# EAGLE design amplifier (EAGLE 8.4.1)
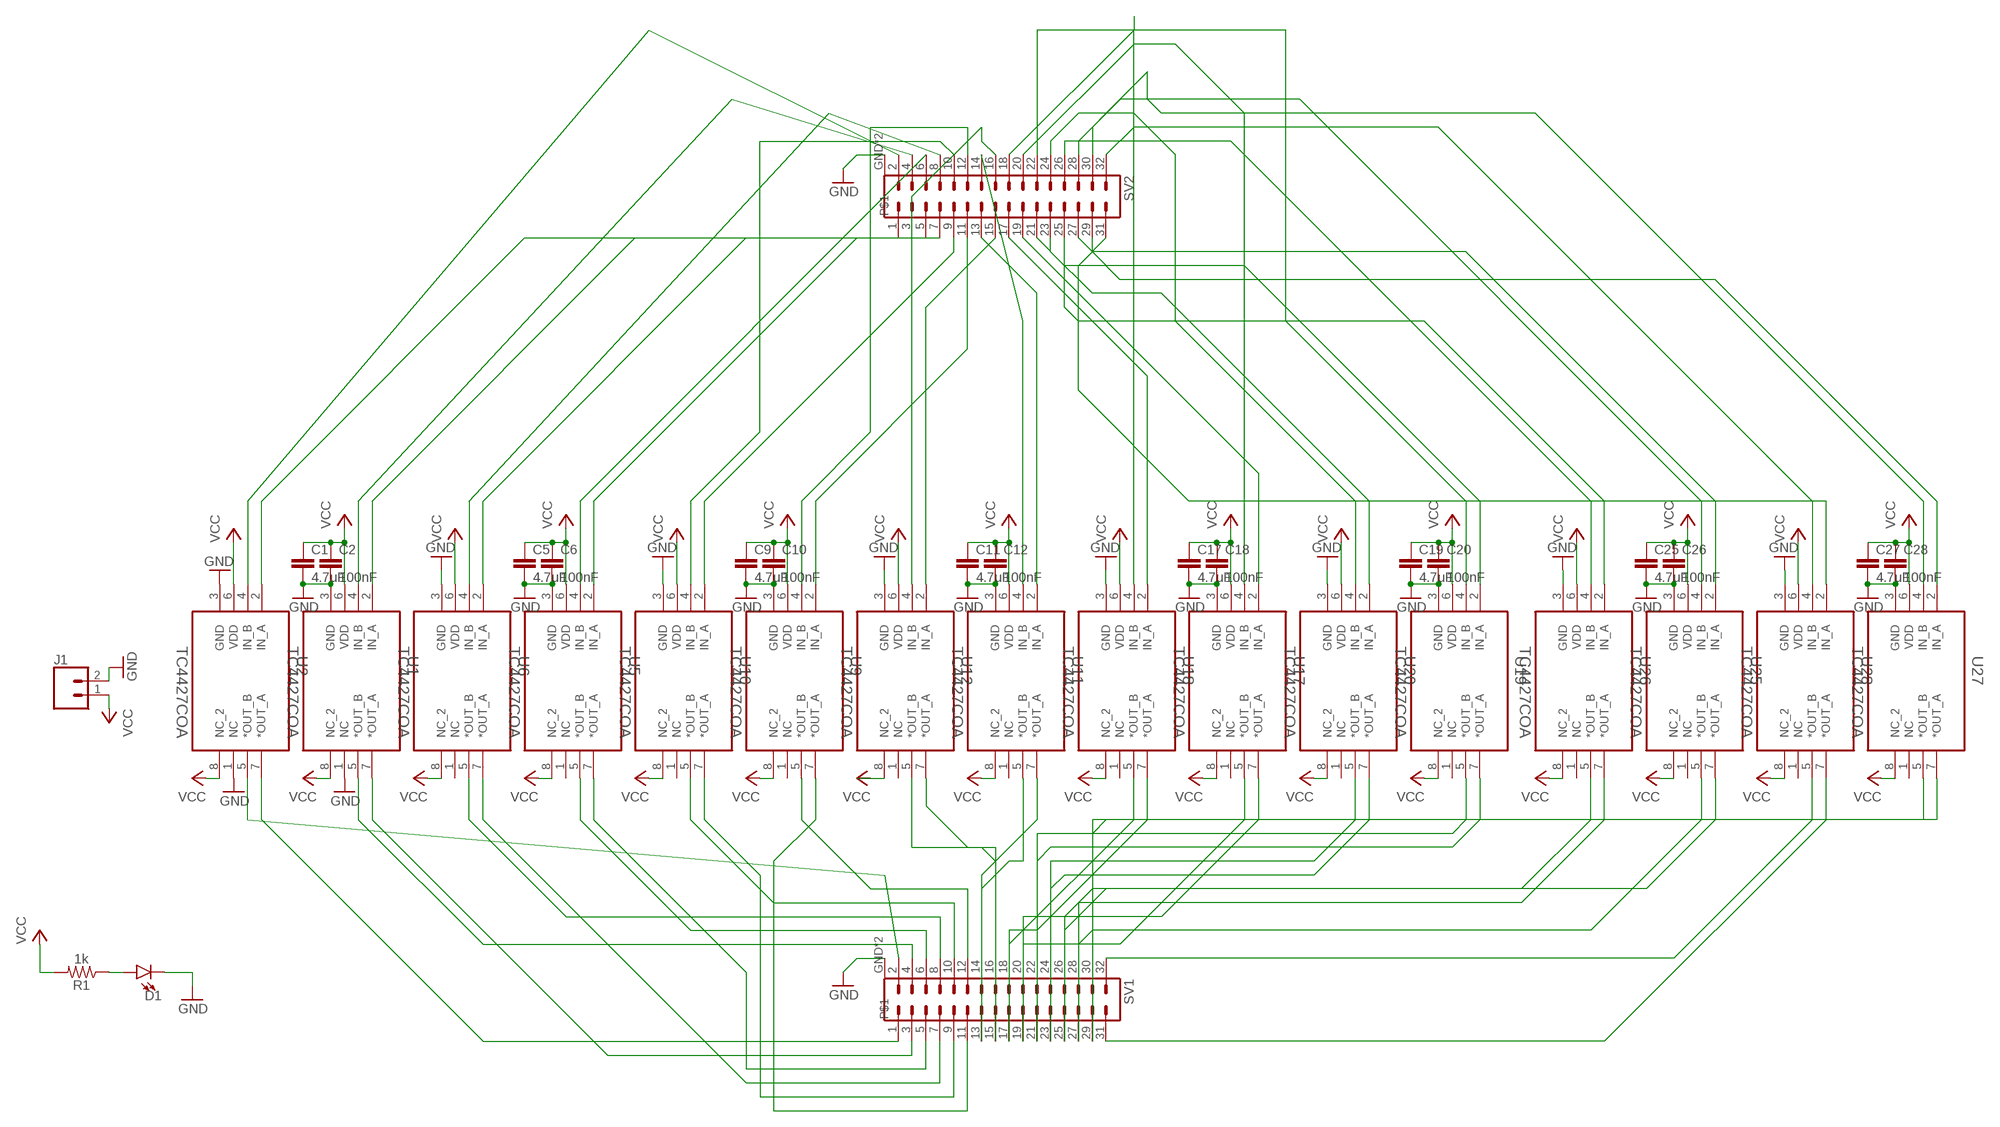
[diagram p0: schematic, sheet 1]

## Parts
C1  4.7uF  C-EUC0805  [C0805]
C2  100nF  C-EUC0805  [C0805]
C5  4.7uF  C-EUC0805  [C0805]
C6  100nF  C-EUC0805  [C0805]
C9  4.7uF  C-EUC0805  [C0805]
C10  100nF  C-EUC0805  [C0805]
C11  4.7uF  C-EUC0805  [C0805]
C12  100nF  C-EUC0805  [C0805]
C17  4.7uF  C-EUC0805  [C0805]
C18  100nF  C-EUC0805  [C0805]
C19  4.7uF  C-EUC0805  [C0805]
C20  100nF  C-EUC0805  [C0805]
C25  4.7uF  C-EUC0805  [C0805]
C26  100nF  C-EUC0805  [C0805]
C27  4.7uF  C-EUC0805  [C0805]
C28  100nF  C-EUC0805  [C0805]
D1  LED0603  [LED-0603]
J1  CONN_02PTH3  [1X02_LONGPADS]
R1  1k  0.22OHM-0805-1/4W-1%  [0805]
SV1  MA20-2W  [MA20-2W]
SV2  MA20-2W  [MA20-2W]
U1  TC4427COA  [SOIC127P600X175-8N]
U2  TC4427COA  [SOIC127P600X175-8N]
U5  TC4427COA  [SOIC127P600X175-8N]
U6  TC4427COA  [SOIC127P600X175-8N]
U9  TC4427COA  [SOIC127P600X175-8N]
U10  TC4427COA  [SOIC127P600X175-8N]
U11  TC4427COA  [SOIC127P600X175-8N]
U12  TC4427COA  [SOIC127P600X175-8N]
U17  TC4427COA  [SOIC127P600X175-8N]
U18  TC4427COA  [SOIC127P600X175-8N]
U19  TC4427COA  [SOIC127P600X175-8N]
U20  TC4427COA  [SOIC127P600X175-8N]
U25  TC4427COA  [SOIC127P600X175-8N]
U26  TC4427COA  [SOIC127P600X175-8N]
U27  TC4427COA  [SOIC127P600X175-8N]
U28  TC4427COA  [SOIC127P600X175-8N]

## Nets
GND: C1.2 C2.2 C5.2 C6.2 C9.2 C10.2 C11.2 C12.2 C17.2 C18.2 C19.2 C20.2 C25.2 C26.2 C27.2 C28.2 D1.C J1.2 SV1.GND SV1.GND+1 SV2.GND SV2.GND+1 U1.1(NC) U1.3(GND) U2.1(NC) U2.3(GND) U5.1(NC) U5.3(GND) U6.1(NC) U6.3(GND) U9.1(NC) U9.3(GND) U10.1(NC) U10.3(GND) U11.1(NC) U11.3(GND) U12.1(NC) U12.3(GND) U17.1(NC) U17.3(GND) U18.1(NC) U18.3(GND) U19.1(NC) U19.3(GND) U20.1(NC) U20.3(GND) U25.1(NC) U25.3(GND) U26.1(NC) U26.3(GND) U27.1(NC) U27.3(GND) U28.1(NC) U28.3(GND)
N$1: SV2.2 U2.4(IN_B)
N$2: SV1.2 U2.5(*OUT_B)
N$3: SV1.4 U1.5(*OUT_B)
N$4: SV2.4 U1.4(IN_B)
N$5: SV2.3 U1.2(IN_A)
N$6: SV2.1 U2.2(IN_A)
N$7: SV1.16 U12.5(*OUT_B)
N$8: SV1.24 U20.5(*OUT_B)
N$9: SV1.8 U6.5(*OUT_B)
N$10: SV1.1 U2.7(*OUT_A)
N$11: SV1.3 U1.7(*OUT_A)
N$12: SV1.7 U6.7(*OUT_A)
N$13: SV1.10 U10.5(*OUT_B)
N$14: SV1.9 U10.7(*OUT_A)
N$15: SV1.11 U9.7(*OUT_A)
N$16: SV1.23 U20.7(*OUT_A)
N$17: SV2.6 U5.4(IN_B)
N$18: SV2.5 U5.2(IN_A)
N$19: SV2.8 U6.4(IN_B)
N$20: D1.A R1.1
N$22: SV2.7 U6.2(IN_A)
N$23: SV1.5 U5.7(*OUT_A)
N$24: SV1.6 U5.5(*OUT_B)
N$26: SV1.15 U12.7(*OUT_A)
N$29: SV1.12 U9.5(*OUT_B)
N$33: SV2.12 U9.4(IN_B)
N$34: SV2.11 U9.2(IN_A)
N$35: SV2.10 U10.4(IN_B)
N$38: SV2.9 U10.2(IN_A)
N$41: SV2.14 U11.4(IN_B)
N$42: SV2.13 U11.2(IN_A)
N$43: SV2.16 U12.4(IN_B)
N$46: SV2.15 U12.2(IN_A)
N$47: SV1.13 U11.7(*OUT_A)
N$48: SV1.14 U11.5(*OUT_B)
N$65: SV2.20 U17.4(IN_B)
N$66: SV2.19 U17.2(IN_A)
N$67: SV2.18 U18.4(IN_B)
N$68: SV1.17 U18.7(*OUT_A)
N$69: SV1.18 U18.5(*OUT_B)
N$70: SV2.17 U18.2(IN_A)
N$71: SV1.19 U17.7(*OUT_A)
N$72: SV1.20 U17.5(*OUT_B)
N$73: SV2.22 U19.4(IN_B)
N$74: SV2.21 U19.2(IN_A)
N$75: SV2.24 U20.4(IN_B)
N$78: SV2.23 U20.2(IN_A)
N$79: SV1.21 U19.7(*OUT_A)
N$80: SV1.22 U19.5(*OUT_B)
N$97: SV2.28 U25.4(IN_B)
N$98: SV2.27 U25.2(IN_A)
N$99: SV2.26 U26.4(IN_B)
N$100: SV1.25 U26.7(*OUT_A)
N$101: SV1.26 U26.5(*OUT_B)
N$102: SV2.25 U26.2(IN_A)
N$103: SV1.27 U25.7(*OUT_A)
N$104: SV1.28 U25.5(*OUT_B)
N$105: SV2.30 U27.4(IN_B)
N$106: SV2.29 U27.2(IN_A)
N$107: SV2.32 U28.4(IN_B)
N$108: SV1.31 U28.7(*OUT_A)
N$109: SV1.32 U28.5(*OUT_B)
N$110: SV2.31 U28.2(IN_A)
N$111: SV1.29 U27.7(*OUT_A)
N$112: SV1.30 U27.5(*OUT_B)
VDD: C1.1 C2.1 C5.1 C6.1 C9.1 C10.1 C11.1 C12.1 C17.1 C18.1 C19.1 C20.1 C25.1 C26.1 C27.1 C28.1 J1.1 R1.2 U1.6(VDD) U1.8(NC_2) U2.6(VDD) U2.8(NC_2) U5.6(VDD) U5.8(NC_2) U6.6(VDD) U6.8(NC_2) U9.6(VDD) U9.8(NC_2) U10.6(VDD) U10.8(NC_2) U11.6(VDD) U11.8(NC_2) U12.6(VDD) U12.8(NC_2) U17.6(VDD) U17.8(NC_2) U18.6(VDD) U18.8(NC_2) U19.6(VDD) U19.8(NC_2) U20.6(VDD) U20.8(NC_2) U25.6(VDD) U25.8(NC_2) U26.6(VDD) U26.8(NC_2) U27.6(VDD) U27.8(NC_2) U28.6(VDD) U28.8(NC_2) ; supply symbol labelled VCC

## Library data of the parts
C1 C2 C5 C6 C9-C12 C17-C20 C25-C28 = rcl:C-EU: CAPACITOR, European symbol
D1 = SparkFun-LED:LED: LED (Generic) Standard schematic elements and footprints for 5mm, 3mm, 1206, and 0603 sized LEDs. Generic LEDs with no color specified.
J1 = SparkFun-Connectors:CONN_02: Multi connection point. Often used as Generic Header-pin footprint for 0.1 inch spaced/style header connections On any of the 0.1 inch spaced packages, you can populate with these: Break Away Headers - Straight <https://www.sparkfun.com/products/116> (PRT-00116) Break Away Male Headers - Right Angle <https://www.sparkfun.com/products/553> (PRT-00553) Female Headers <https://www.sparkfun.com/products/115> (PRT-00115) Break Away Headers - Machine Pin <https://www.sparkfun.com/products/117> (PRT-00117) Break Away Female Headers - Swiss Machine Pin <https://www.sparkfun.com/products/743> (PRT-00743) For SCREWTERMINALS and SPRING TERMINALS visit here: Screw Terimnals on SparkFun.com <https://www.sparkfun.com/search/results?term=Screw+Terminals> (5mm/3.5mm/2.54mm spacing) This device is also useful as a general connection point to wire up your design to another part of your project. Our various solder wires solder well into these plated through hole pads. Hook-Up Wire - Assortment (Stranded, 22 AWG) <https://www.sparkfun.com/products/11375> (PRT-11375) Hook-Up Wire - Assortment (Solid Core, 22 AWG) <https://www.sparkfun.com/products/11367> (PRT-11367) View the entire wire category on our website here <https://www.sparkfun.com/categories/141> Special notes: Molex polarized connector foot print use with: PRT-08233 with associated crimp pins and housings. 2.54_SCREWTERM for use with PRT-10571. 3.5mm Screw Terminal footprints for PRT-08084 5mm Screw Terminal footprints for use with PRT-08432
R1 = SparkFun-Resistors:0.22OHM: 0.22Ω resistor A resistor is a passive two-terminal electrical component that implements electrical resistance as a circuit element. Resistors act to reduce current flow, and, at the same time, act to lower voltage levels within circuits. - Wikipedia; PROD_ID: RES-09883; VALUE: 0.22
SV1 SV2 = Parts:MA20-2W: PIN HEADER; OC_FARNELL: unknown; OC_NEWARK: unknown
U1 U2 U5 U6 U9-U12 U17-U20 U25-U28 = Microchip_By_element14_Batch_1:TC4427COA: IC, MOSFET DRIVER, LOW SIDE; MPN: TC4427COA; OC_FARNELL: 9762620; OC_NEWARK: 61K3538; PACKAGE: 8SOIC; SUPPLIER: Microchip

## Net classes
0 default: width 0.406 mm

## Board
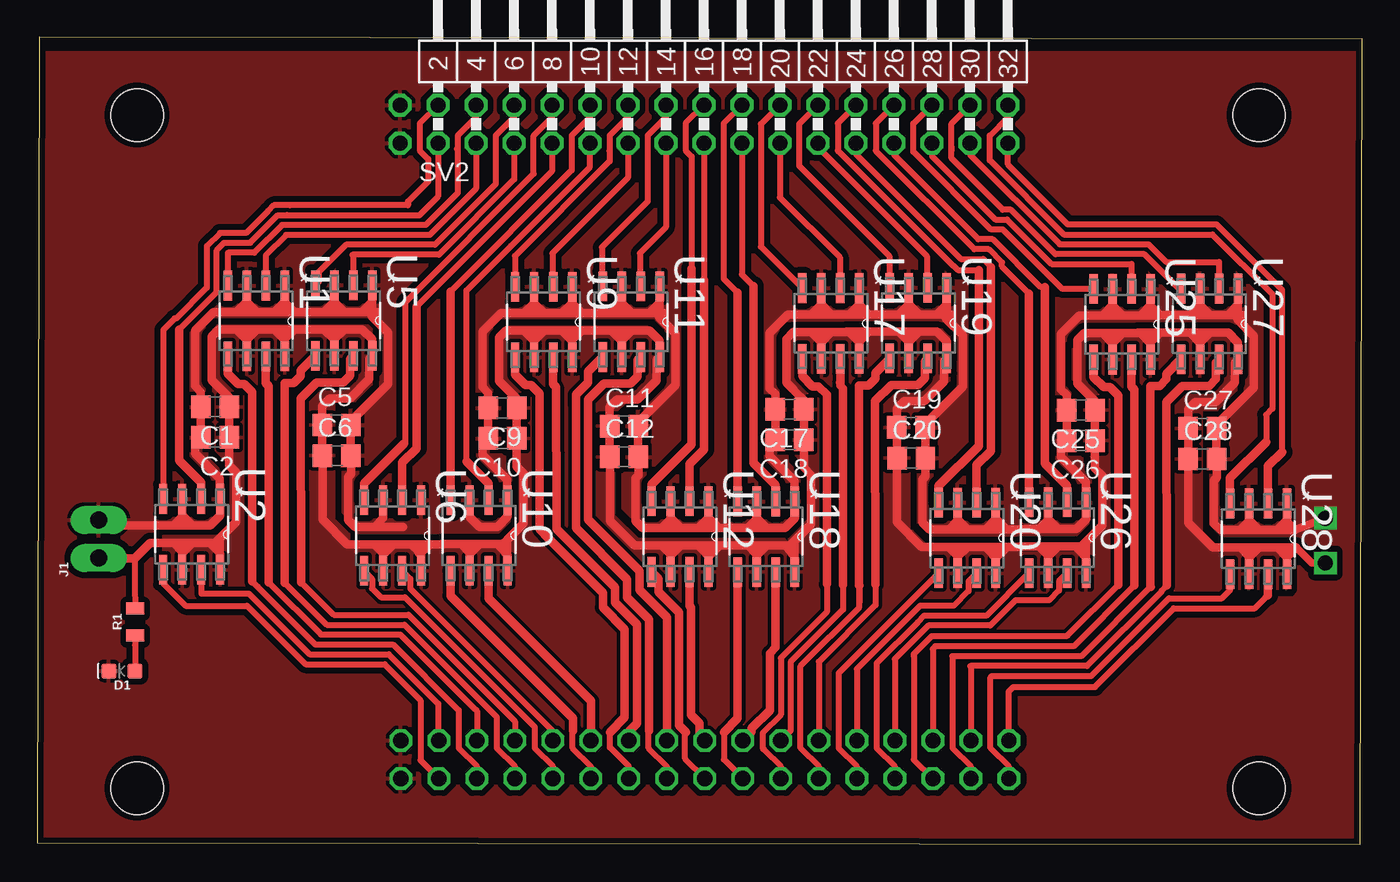
[diagram p1: board, top side]
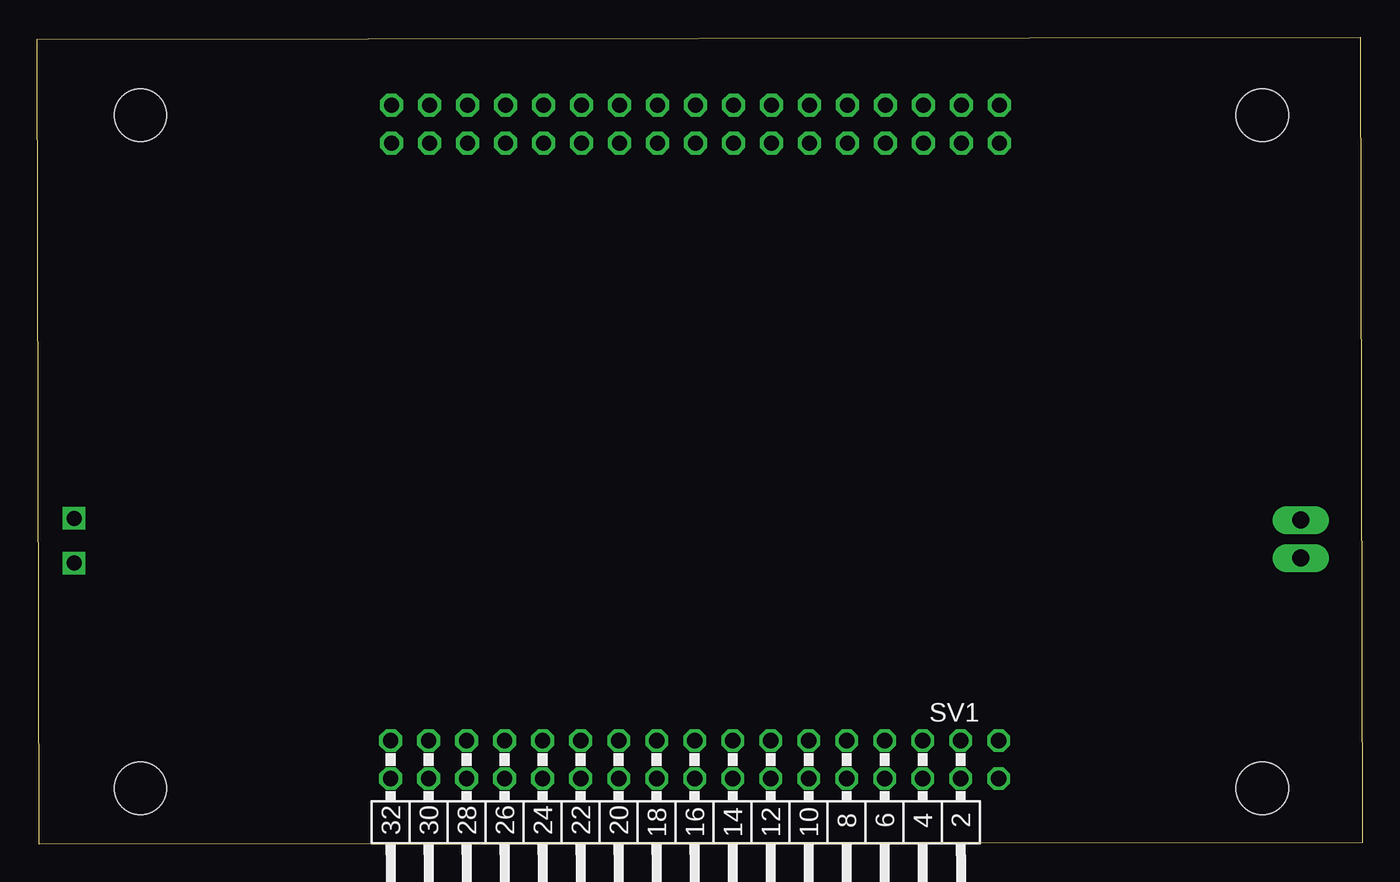
[diagram p2: board, bottom side, seen from below]

Size 88.55 x 53.95 mm. Coordinates in mm from the lower left corner, seen from the top.
Outline: 0,0.11 88.44,0 88.55,53.84 0.11,53.96 0,0.11
Copper layers (1*16): Top 0.035mm / dielectric 1.5mm / Bottom 0.035mm
Design rules "steve": minimum track width 10mil, minimum drill 24mil, track to track 10mil, track to pad 10mil, pad to pad 10mil, via to via 10mil, smd to smd 10mil, copper to edge 10mil, drill to drill 10mil, minimum pad ring 10mil, minimum via ring 10mil, stop-mask expansion 4mil, vias tented up to drill 0mil, thermal gap 10mil
Holes 3.5 mm at 6.66,48.76 81.66,48.76 81.66,3.76 6.66,3.76

### Footprints (pad centres in the part's own frame; a part is rotated, then mirrored left to right if it is on the bottom)
C0805 = smd 1.3 x 1.5: 1 -0.95,0; 2 0.95,0
LED-0603 = smd 1 x 1: A -0.877,0; C 0.877,0
1X02_LONGPADS = drill 1.118 pad 1.88 long: 1 0,0; 2 2.54,0
0805 = smd 0.8 x 1.2: 1 -0.9,0; 2 0.9,0
MA20-2W = drill 1.016 octagon: 1 -24.13,-1.27; 2 -24.13,1.27; 3 -21.59,-1.27; 4 -21.59,1.27; 5 -19.05,-1.27; 6 -19.05,1.27; 7 -16.51,-1.27; 8 -16.51,1.27; 9 -13.97,-1.27; 10 -13.97,1.27; 11 -11.43,-1.27; 12 -11.43,1.27; 13 -8.89,-1.27; 14 -8.89,1.27; 15 -6.35,-1.27; 16 -6.35,1.27; 17 -3.81,-1.27; 18 -3.81,1.27; 19 -1.27,-1.27; 20 -1.27,1.27; 21 1.27,-1.27; 22 1.27,1.27; 23 3.81,-1.27; 24 3.81,1.27; 25 6.35,-1.27; 26 6.35,1.27; 27 8.89,-1.27; 28 8.89,1.27; 29 11.43,-1.27; 30 11.43,1.27; 31 13.97,-1.27; 32 13.97,1.27; GND -26.67,1.27; GND+1 -26.67,-1.27
SOIC127P600X175-8N = smd 1.981 x 0.559: 1 -2.362,1.905; 2 -2.362,0.635; 3 -2.362,-0.635; 4 -2.362,-1.905; 5 2.362,-1.905; 6 2.362,-0.635; 7 2.362,0.635; 8 2.362,1.905

### Placement (x,y rotation side)
C1  11.88,29.25 180 top
C2  11.87,27.22 180 top
C5  20,28.04 0 top
C6  20.01,25.99 0 top
C9  31.09,29.18 180 top
C10  31.08,27.14 180 top
C11  39.21,27.97 0 top
C12  39.22,25.92 0 top
C17  50.28,29.09 180 top
C18  50.28,27.05 180 top
C19  58.4,27.88 0 top
C20  58.41,25.83 0 top
C25  69.75,29.03 180 top
C26  69.75,26.99 180 top
C27  77.87,27.82 0 top
C28  77.88,25.77 0 top
D1  5.65,11.59 180 top
J1  4.1,19.15 90 top
R1  6.54,14.87 90 top
SV1  50.96,5.67 180 bottom
SV2  50.91,48.16 0 top
U1  14.63,35 270 top
U2  10.31,20.73 270 top
U5  20.48,35.02 270 top
U6  23.75,20.65 270 top
U9  33.84,34.92 270 top
U10  29.52,20.65 270 top
U11  39.69,34.95 270 top
U12  42.96,20.58 270 top
U17  53.03,34.83 270 top
U18  48.72,20.56 270 top
U19  58.88,34.85 270 top
U20  62.15,20.49 270 top
U25  72.5,34.77 270 top
U26  68.19,20.51 270 top
U27  78.35,34.8 270 top
U28  81.62,20.43 270 top

### Tracks (layer width: path | path; a pad name or v marks a point on that pad's centre or on a via)
GND  (via drill 1 pad 1.3)
  Top 0.508: 84.06,21.01 86.04,21.81 v86.1,21.79
  Top 0.559: C1.2 C2.2 10.54,26.84 10.54,26.12 12.2,24.47 12.2,23.84 12.22,23.82 U2.1 12.23,23.08 12.23,21.99 11.56,21.31 10.34,21.31 9.68,21.98 U2.3 9.68,21.89 9.1,21.31 | C1.2 10.54,29.64 | 14.66,35.58 14,36.25 | U1.1 16.54,36.25 15.87,35.58 14.66,35.58 | C1.2 10.93,30.26 10.54,30.65 10.54,34.35 11.78,35.58 13.33,35.58 | 13.33,35.58 14.66,35.58 | U1.3 14,36.25 | 14,36.25 13.33,35.58 | 9.1,21.31 11.02,21.31 | 9.1,21.31 8.19,21.31 | 8.19,21.31 8.18,21.31 | 16.48,35.58 15.4,35.58 | 16.48,35.58 16.84,35.58 | U1.1 16.54,35.63 16.5,35.6 | 20.51,35.6 19.84,36.27 | 20.51,35.6 21.72,35.6 22.38,36.27 U5.1 22.38,35.66 22.33,35.6 | 19.18,35.6 20.51,35.6 | U5.3 19.84,36.27 | 19.84,36.27 19.18,35.6 | 22.53,21.23 24.45,21.23 | 21.91,21.23 21.62,21.23 21.61,21.23 | 21.91,21.23 22.53,21.23 | U6.3 23.11,21.81 22.53,21.23 | 21.25,35.6 22.33,35.6 | 22.33,35.6 22.69,35.6 | 17.15,35.6 19.18,35.6 | 17.15,35.6 16.5,35.6 | 16.5,35.6 16.48,35.58 | U1.1 16.54,36.22 17.15,35.6 | 22.33,35.6 22.33,35.33 23.45,34.21 23.45,30.78 20.95,28.27 C5.2 20.95,26 C6.2 20.96,24.75 20.77,24.57 20.77,21.7 21.24,21.23 21.91,21.23 | 21.91,21.23 | U10.3 28.89,21.9 29.55,21.24 30.77,21.24 31.44,21.91 31.44,23 U10.1 31.43,23.75 31.41,23.77 31.41,24.39 29.75,26.05 29.75,26.76 C10.2 C9.2 | C9.2 29.75,29.57 | 33.87,35.51 33.2,36.17 | U9.1 35.74,36.17 35.08,35.51 33.87,35.51 | C9.2 30.14,30.19 29.75,30.57 29.75,34.27 30.99,35.51 32.54,35.51 | 32.54,35.51 33.87,35.51 | U9.3 33.2,36.17 | 33.2,36.17 32.54,35.51 | 35.69,35.51 34.61,35.51 | 35.69,35.51 36.05,35.51 36.05,35.5 | U9.1 35.74,35.56 35.71,35.53 | 44.2,21.16 44.87,21.83 44.87,22.93 U12.1 44.86,21.84 45.54,21.16
  Top 0.559: 44.2,21.16 42.98,21.16 42.32,21.83 U12.3 42.32,21.74 41.74,21.16 | 39.72,35.53 39.05,36.19 | 39.72,35.53 40.93,35.53 41.59,36.19 U11.1 41.59,35.58 41.54,35.53 | 38.39,35.53 39.72,35.53 | U11.3 39.05,36.19 | 39.05,36.19 38.39,35.53 | 41.74,21.16 43.66,21.16 | 41.12,21.16 40.83,21.16 40.82,21.16 | 41.12,21.16 41.74,21.16 | 40.45,35.53 41.54,35.53 | 41.54,35.53 41.9,35.53 41.9,35.52 | 36.36,35.53 38.39,35.53 | 36.36,35.53 35.71,35.53 | 35.71,35.53 35.69,35.51 | U9.1 35.74,36.15 36.36,35.53 | 41.54,35.53 41.54,35.26 42.66,34.14 42.66,30.71 40.15,28.2 C11.2 40.15,25.93 C12.2 40.17,24.68 39.98,24.49 39.98,21.62 40.44,21.16 41.12,21.16 | 41.12,21.16 | C17.2 C18.2 48.95,26.67 48.95,25.95 50.6,24.3 50.6,23.68 50.62,23.66 U18.1 50.64,22.91 50.64,21.82 49.96,21.15 48.75,21.15 48.08,21.81 U18.3 48.08,21.73 47.5,21.15 | C17.2 48.95,29.48 | 53.06,35.42 52.4,36.08 | U17.1 54.94,36.08 54.27,35.42 53.06,35.42 | C17.2 49.33,30.1 48.95,30.48 48.95,34.18 50.18,35.42 51.73,35.42 | 51.73,35.42 53.06,35.42 | U17.3 52.4,36.08 | 52.4,36.08 51.73,35.42 | 47.5,21.15 49.43,21.15 | 47.14,21.15 46.59,21.15 46.58,21.14 | 47.14,21.15 47.5,21.15 | 54.89,35.42 53.8,35.42 | 54.89,35.42 55.24,35.42 55.25,35.41 | U17.1 54.94,35.47 54.91,35.44 | 63.39,21.07 64.07,21.74 | 64.07,21.74 64.07,22.83 U20.1 | 63.39,21.07 62.18,21.07 61.51,21.73 U20.3 61.51,21.65 60.94,21.07 | 58.91,35.44 58.25,36.1 | 58.91,35.44 60.12,35.44 60.79,36.1 U19.1 60.79,35.49 60.73,35.44 | 57.58,35.44 58.91,35.44 | U19.3 58.25,36.1 | 58.25,36.1 57.58,35.44 | 60.94,21.07 62.86,21.07 | 60.32,21.07 60.02,21.07 | 60.32,21.07 60.94,21.07 | 59.65,35.44 60.73,35.44 | 60.73,35.44 61.09,35.44 61.1,35.43
  Top 0.559: 55.56,35.44 57.58,35.44 | 55.56,35.44 54.91,35.44 | 54.91,35.44 54.89,35.42 | U17.1 54.94,36.06 55.56,35.44 | 60.73,35.44 60.73,35.17 61.85,34.05 61.85,30.61 59.35,28.11 C19.2 59.35,25.84 C20.2 59.36,24.59 59.18,24.4 59.18,21.53 59.64,21.07 60.32,21.07 | 60.32,21.07 | C25.2 C26.2 68.42,26.61 68.42,25.9 70.07,24.24 70.07,23.62 70.09,23.6 U26.1 70.11,22.85 70.11,21.76 69.43,21.09 68.22,21.09 67.55,21.75 U26.3 67.55,21.67 66.98,21.09 | C25.2 68.42,29.42 | 72.53,35.36 71.87,36.02 | U25.1 74.41,36.02 73.75,35.36 72.53,35.36 | C25.2 68.8,30.04 68.42,30.42 68.42,34.12 69.65,35.36 71.21,35.36 | 71.21,35.36 72.53,35.36 | U25.3 71.87,36.02 | 71.87,36.02 71.21,35.36 | 66.98,21.09 68.9,21.09 | 66.98,21.09 66.06,21.09 | 74.36,35.36 73.27,35.36 | 74.36,35.36 74.71,35.36 74.72,35.35 | U25.1 74.41,35.41 74.38,35.38 | 82.87,21.01 83.54,21.69 | 83.54,21.69 83.54,22.78 U28.1 | 82.87,21.01 81.65,21.01 80.99,21.68 U28.3 80.99,21.59 80.41,21.01 | 78.38,35.38 77.72,36.05 | 78.38,35.38 79.59,35.38 80.26,36.05 U27.1 80.26,35.43 80.21,35.38 | 77.05,35.38 78.38,35.38 | U27.3 77.72,36.05 | 77.72,36.05 77.05,35.38 | 80.41,21.01 82.33,21.01 | 79.79,21.01 79.49,21.01 | 79.79,21.01 80.41,21.01 | 79.12,35.38 80.21,35.38 | 80.21,35.38 80.56,35.38 80.57,35.38 | 75.03,35.38 77.05,35.38 | 75.03,35.38 74.38,35.38 | 74.38,35.38 74.36,35.36 | U25.1 74.41,36 75.03,35.38 | 80.21,35.38 80.21,35.11 81.33,33.99 81.33,30.56 78.82,28.05 C27.2 78.82,25.78 C28.2 78.83,24.53 78.65,24.35 78.65,21.47 79.11,21.01 79.79,21.01 | 79.79,21.01 | 45.54,21.16 46.19,21.16 46.21,21.15 47.14,21.15 | 45.54,21.16 44.2,21.16 | 47.14,21.15 | 64.76,21.07 63.39,21.07
  Top 0.559: 64.76,21.07 66.96,21.07 66.98,21.09 | 64.07,21.74 64.09,21.74 64.76,21.07 | 8.19,21.31 4.48,21.31 J1.2 | 82.87,21.01 84.06,21.01 83.54,21.53 83.54,21.69
  pour Top (isolate 0.406, rank 2): 0.41,52.92 88.5,52.93 88.5,0.04 0.08,0.04 0.09,52.72 0.21,52.92
N$1
  Top 0.406: 16.89,42.73 | 16.89,42.73 24.77,42.73 24.77,42.98 26.12,44.32 26.12,45.83 25.56,46.38 25.56,48.21 SV2.2 | U2.4 8.41,34.4 9.17,35.16 9.28,35.16 11.33,37.21 11.33,40.01 12.21,40.88 13.95,40.88 15.41,42.34 | 15.41,42.34 15.8,42.73 16.89,42.73 | 15.41,42.34
N$2
  Top 0.406: SV1.2 25.62,5.62 25.62,9.64 23.21,12.04 17.92,12.04 14.01,15.96 9.9,15.96 8.41,17.45 U2.5
N$3
  Top 0.406: 14.37,17.57 14.72,17.22 14.72,17.21 18.57,13.36 18.94,13.36 | 19.23,13.36 | 18.94,13.36 19.23,13.36 | 18.94,13.36 23.76,13.36 28.16,8.97 28.16,6.44 29.37,5.22 SV1.4
  Top 0.559: U1.5 12.73,31.48 13.41,30.79 13.8,30.79 14.37,30.23 14.37,17.57
N$4
  Top 0.406: 28.1,46.55 28.1,47.39 29.32,48.61 SV2.4 | 28.1,46.55 28.04,46.49 | 28.1,46.55 28.1,43.55 25.95,41.41 16.35,41.41 14.5,39.56 12.75,39.56 12.73,39.54 U1.4
N$5
  Top 0.406: SV2.3 29.32,43.84 26.23,40.75 20.91,40.75 | 20.91,40.75 | 20.91,40.75 16.62,40.75 15.27,39.39 U1.2
N$6
  Top 0.406: SV2.1 26.78,43.31 25.54,42.07 16.73,42.07 | 16.73,42.07 16.62,42.07 | 16.62,42.07 | 9.48,34.42 11.99,36.94 11.99,39.73 12.48,40.22 14.23,40.22 16.07,42.07 16.62,42.07 | 16.62,42.07 | 16.62,42.07 16.73,42.07
  Top 0.559: U2.2 10.95,24.2 9.48,25.68 9.48,34.42
N$7
  Top 0.406: SV1.16 43.29,5.72 43.29,7.45 43.34,7.5
  Top 0.559: U12.5 41.51,17.76 41.51,16.88 42.89,15.5 42.89,7.96 43.34,7.5
N$8
  Top 0.406: SV1.24 54.77,5.22 53.56,6.44 53.56,11.44 U20.5
N$9
  Top 0.406: U6.5 22.37,17.75 22.37,17.11 22.97,16.52 24.57,16.52 33.24,7.85 33.24,6.44 34.45,5.22 SV1.8
N$10
  Top 0.406: SV1.1 26.8,6.98 26.8,9.4 23.49,12.7 18.2,12.7 14.13,16.77 10.95,16.77 U2.7
N$11
  Top 0.406: 15.46,17.52 18.96,14.02 24.26,14.02 24.28,14 29.13,9.16 | 29.13,9.16 | 29.13,9.16 29.37,8.91 SV1.3
  Top 0.559: U1.7 15.27,31.04 | 15.27,31.04 15.26,31.03 | 15.27,31.04 15.27,30.84 15.46,30.65 15.46,17.52
N$12
  Top 0.406: U6.7 24.91,17.75 24.91,17.11 34.45,7.57 SV1.7
N$13
  Top 0.406: SV1.10 36.99,5.22 35.78,6.44 35.78,7.45 35.8,7.47 35.8,7.86
  Top 0.559: U10.5 27.62,16.61 35.8,8.43 35.8,7.86 35.8,7.58
N$14
  Top 0.559: U10.7 30.16,16.44 37.01,9.59 37.01,6.96 SV1.9
N$15
  Top 0.559: U9.7 34.47,30.97 | 34.47,30.97 34.47,30.96 | 34.47,30.97 34.47,30.77 34.67,30.57 34.69,21.92 34.69,21.08 38.61,17.17 38.61,16.17 40.07,14.71 | 40.07,14.71 40.07,14.69 | SV1.11 39.53,7.54 40.07,8.08 40.07,14.71
N$16
  Top 0.406: U20.7 62.25,17.59 62.25,16.94 61.25,15.95 59,15.95 54.77,11.72 SV1.23
N$17
  Top 0.406: SV2.6 31.86,48.61 30.64,47.39 30.64,44.16 26.57,40.09 20.64,40.09 18.8,38.26 18.8,37.61 U5.4
N$18
  Top 0.406: SV2.5 31.88,46.87 31.88,44.46 26.84,39.43 21.06,39.43 21.11,39.38 U5.2
N$19
  Top 0.406: SV2.8 34.4,48.61 33.18,47.39 33.18,44.83 24.6,36.25 24.6,26.88 24.52,26.81
  Top 0.559: 24.52,26.81 21.84,24.13 U6.4
N$20
  Top 0.406: R1.1 6.54,13.34 D1.A
N$22
  Top 0.406: SV2.7 34.4,45.01 25.33,35.94
  Top 0.559: U6.2 24.38,25.52 25.33,26.47 25.33,35.94
N$23
  Top 0.406: 17.63,17.53 19.81,15.35 24.81,15.35 31.91,8.24 SV1.5
  Top 0.559: U5.7 20.91,32.45 20.91,31.34 20.45,30.88 18.67,30.88 17.59,29.8 17.63,17.53
N$24
  Top 0.406: 16.53,17.5 19.34,14.69 24.53,14.69 30.7,8.52 30.7,6.44 31.91,5.22 SV1.6
  Top 0.559: U5.5 17.6,31.69 17.6,31.32 17.14,30.86 16.53,30.86 16.53,17.5
N$26
  Top 0.559: SV1.15 44.26,7.29 44.26,8.1 43.7,8.66 43.7,15.84 43.59,15.95 U12.7
N$29
  Top 0.406: SV1.12 39.53,5.22 38.26,6.49 38.26,7.5
  Top 0.559: U9.5 31.93,31.41 32.62,30.72 33.01,30.72 33.58,30.16 33.58,21.1 33.88,20.8 33.88,20.75 37.8,16.83 37.8,15.84 39.26,14.38 39.26,8.5 38.26,7.5
N$33
  Top 0.406: 38.26,46.39 38.26,47.39 39.48,48.61 SV2.12 | 38.26,46.39 38.22,46.36 | 38.26,46.39 38.26,45.67 31.92,39.34 U9.4
N$34
  Top 0.406: SV2.11 39.48,44.57 34.43,39.52 34.43,37.34 U9.2
N$35
  Top 0.406: SV2.10 36.94,48.61 35.72,47.39 35.72,46.38 35.72,45.07 27.62,36.97
  Top 0.559: 27.62,36.97 U10.4
N$38
  Top 0.406: 31.65,40 | 28.69,25.6 28.69,37.04 31.65,40 | SV2.9 36.94,45.29 31.65,40
  Top 0.559: U10.2 30.16,24.13 28.69,25.6
N$41
  Top 0.406: SV2.14 42.02,48.61 40.8,47.39 40.8,42.99 37.73,39.92 37.73,37.36 U11.4
N$42
  Top 0.406: SV2.13 42.02,41.26 40.28,39.52 40.28,37.35 U11.2
N$43
  Top 0.406: SV2.16 43.34,48.21 43.34,46.38 43.73,45.99 43.73,38.49
  Top 0.559: 43.73,38.49 43.73,26.73 41.05,24.05 U12.4
N$46
  Top 0.406: 44.54,46.88 SV2.15 44.56,37.74 44.54,37.72
  Top 0.559: U12.2 43.59,25.44 44.54,26.4 44.54,37.72
N$47
  Top 0.559: U11.7 40.12,32.38 40.12,31.27 39.66,30.81 37.88,30.81 36.8,29.73 36.82,21.71 40.24,18.29 40.24,17 42.07,15.17 SV1.13
N$48
  Top 0.406: SV1.14 42.07,5.22 40.86,6.44 40.86,7.55 40.88,7.58
  Top 0.559: U11.5 36.81,31.61 36.81,30.89 36.23,30.3 35.99,30.07 35.99,30.06 | 40.88,7.58 40.88,15.05 39.42,16.51 39.42,17.71 36,21.14 35.99,29.39 35.99,29.73 35.99,30.06 | 35.99,30.06
N$65
  Top 0.406: SV2.20 48.37,48.16 48.37,39.96 U17.4
N$66
  Top 0.406: SV2.19 49.64,43.25 53.64,39.25 53.64,37.2 U17.2
N$67
  Top 0.406: SV2.18 45.88,48.21 45.88,37.81 46.81,36.88
  Top 0.559: 46.81,36.88 U18.4
N$68
  Top 0.559: SV1.17 47.74,7.53 47.74,7.75 48.96,8.97 48.96,12.77 49.35,13.16 U18.7
N$69
  Top 0.406: 45.88,7.5 45.88,5.67 SV1.18
  Top 0.559: U18.5 46.81,8.43 45.88,7.5
N$70
  Top 0.406: SV2.17 47.1,38.1 47.88,37.32
  Top 0.559: U18.2 49.35,24.04 47.88,25.51 47.88,37.32
N$71
  Top 0.406: 53.86,17.36 53.86,15.7 50.35,12.19 50.35,7.6 SV1.19
  Top 0.559: U17.7 53.67,30.87 | 53.67,30.87 53.66,30.87 | 53.67,30.87 53.67,30.68 53.86,30.48 53.86,17.36
N$72
  Top 0.406: SV1.20 49.69,5.22 48.58,6.33 | 48.58,6.33 48.48,6.44 | 52.77,17.41 52.77,15.54 49.69,12.47 49.69,8.67 48.48,7.45 48.48,6.44 | 48.48,6.44 48.58,6.33
  Top 0.559: U17.5 51.13,31.32 51.82,30.63 52.21,30.63 52.77,30.07 52.77,17.41
N$73
  Top 0.406: SV2.22 50.91,48.17 50.91,45.37 56.95,39.34 56.95,37.22 U19.4
N$74
  Top 0.406: SV2.21 52.18,46.61 59.45,39.34 59.45,37.22 U19.2
N$75
  Top 0.406: 53.54,46.34 53.5,46.38 | SV2.24 53.5,48.21 53.5,46.38 | 62.92,38.4 61.52,38.4 61.26,38.66 61.22,38.66 53.5,46.38
  Top 0.559: 62.92,38.4 62.92,26.64 60.24,23.96 U20.4
N$78
  Top 0.406: 63.74,38.61 63.66,38.68 63.66,38.7 63.23,39.14 61.72,39.14 54.72,46.14 SV2.23
  Top 0.559: U20.2 62.78,25.35 63.74,26.31 63.74,38.61
N$79
  Top 0.406: SV1.21 52.23,12.2 56.03,16 56.03,17.36
  Top 0.559: U19.7 59.31,32.29 59.31,31.18 58.85,30.71 57.07,30.71 56,29.64 56.03,17.36
N$80
  Top 0.406: 54.94,16.14 54.94,17.32 54.94,15.84 51.02,11.92 51.02,6.44 52.23,5.22 SV1.22
  Top 0.559: U19.5 56,31.52 56,31.15 55.54,30.69 54.93,30.69 54.93,17.32 54.94,17.32
N$97
  Top 0.406: SV2.28 58.56,48.19 58.56,46.31 63.75,41.12 64.54,41.12 68.52,37.14 U25.4
N$98
  Top 0.406: SV2.27 59.8,46 64.02,41.78 64.81,41.78 67.79,38.8 73.14,38.8 U25.2
N$99
  Top 0.406: SV2.26 56.04,48.21 56.04,46.38 56.06,46.36 62.63,39.8 63.59,39.8 64.47,38.91 64.47,38.63 66.28,36.82
  Top 0.559: U26.4 66.28,36.82
N$100
  Top 0.406: U26.7 68.29,17.61 68.29,16.96 67.64,16.32 65.39,16.32 63.7,14.63 59.55,14.63 59.49,14.57 57.39,12.47 | 57.39,12.47 | 57.39,12.47 57.31,12.39 SV1.25
N$101
  Top 0.406: U26.5 63.43,15.29 59.27,15.29 58.84,14.86 56.1,12.11 56.1,6.44 57.31,5.22 SV1.26
N$102
  Top 0.406: SV2.25 57.26,46.1 62.9,40.46 63.86,40.46 67.06,37.26 67.35,37.26
  Top 0.559: U26.2 68.82,23.98 67.35,25.45 67.35,37.26
N$103
  Top 0.406: 73.34,17.3 69.28,13.24 60.03,13.24 59.85,13.06 SV1.27
  Top 0.559: U25.7 73.14,30.82 | 73.14,30.82 73.14,30.81 | 73.14,30.82 73.14,30.62 73.34,30.42 73.34,17.3
N$104
  Top 0.406: SV1.28 58.59,5.67 58.59,12.57 | 58.59,12.57 58.59,12.73 | 72.24,17.35 68.86,13.97 68.8,13.91 59.77,13.91 58.59,12.73 | 58.59,12.73 58.59,12.57
  Top 0.559: U25.5 70.6,31.26 71.29,30.57 71.68,30.57 72.24,30.01 72.24,17.35
N$105
  Top 0.406: SV2.30 61.1,48.2 61.1,46.62 | 61.1,46.62 61.1,46.4 | U27.4 76.3,37.16 74,39.46 68.06,39.46 65.09,42.44 64.54,42.44 61.1,45.87 61.1,46.62
N$106
  Top 0.406: SV2.29 62.34,46.12 68.33,40.12 74.27,40.12 75.46,38.94 78.99,38.94 U27.2
N$107
  Top 0.406: SV2.32 64.88,48.61 63.66,47.39 63.66,45.73 68.61,40.78 78.55,40.78 82.55,36.79 82.55,29.13 82.14,28.72 82.14,26.92
  Top 0.559: 82.14,26.92 79.72,24.49 U28.4
N$108
  Top 0.406: SV1.31 64.93,10.22 65.23,10.52 70.64,10.52 70.69,10.52 75.96,15.79 81.39,15.79 82.26,16.66 82.06,16.47
  Top 0.559: 82.26,16.66 U28.7
N$109
  Top 0.406: SV1.32 64.93,5.22 63.72,6.44 63.72,11.18 63.79,11.26 70.44,11.26 75.64,16.45 79.18,16.45 79.72,16.99 U28.5
N$110
  Top 0.406: 83.21,26.25 83.21,37.06 78.82,41.45 68.88,41.45 64.88,45.45 SV2.31
  Top 0.559: U28.2 82.26,25.29 83.21,26.25
N$111
  Top 0.406: 75.5,17.31 75.15,16.96 75.15,16.9 70.17,11.92 62.37,11.92 62.39,11.89 SV1.29
  Top 0.559: U27.7 78.79,32.23 78.79,31.12 78.32,30.66 76.55,30.66 75.47,29.58 75.5,17.31
N$112
  Top 0.406: 74.4,17.21 69.77,12.58 61.16,12.58 61.18,12.57 61.18,6.44 62.39,5.22 SV1.30
  Top 0.559: U27.5 75.48,31.46 75.48,31.1 75.02,30.63 74.4,30.63 74.4,17.21 74.42,17.21
VDD  (via drill 1 pad 1.3)
  Top 0.406: 6.52,19.13 6.52,17.33 R1.2
  Top 0.508: 84.16,19.84 85.19,18.81 v86.1,18.81
  Top 0.559: 10.34,20.14 9.68,19.48 U2.6 9.68,19.57 9.1,20.14 | 11.55,20.14 12.02,19.68 12.02,19.64 12.22,19.43 U2.8 12.2,18.39 12.2,20.44 | 10.34,20.14 11.55,20.14 | 14.66,34.41 14,33.75 | 13.73,34.41 13.33,34.41 | 13.33,34.41 12.12,34.41 11.66,33.95 11.66,31.04 12.12,30.57 12.28,30.41 12.83,29.87 C1.1 C2.1 12.82,25.35 13.3,24.87 13.3,21.54 12.2,20.44 | 13.73,34.41 14.66,34.41 | 14,33.75 14,34.15 13.73,34.41 | 10.34,20.14 9.1,20.14 | 12.2,20.44 11.9,20.14 11.55,20.14 | 15.65,34.41 15.87,34.41 16.54,33.75 U1.8 16.54,33.82 17.15,34.44 | 15.65,34.41 14.66,34.41 | 13.33,34.41 14,33.75 | 14,33.75 U1.6 | 23.78,20.07 23.11,19.4 U6.6 23.11,19.49 22.53,20.07 | 24.99,20.07 25.45,19.6 25.45,19.56 25.65,19.35 U6.8 | 23.78,20.07 24.99,20.07 | 20.51,34.44 19.84,33.77 | 19.58,34.44 19.18,34.44 | 19.58,34.44 20.51,34.44 | 19.84,33.77 19.84,34.17 19.58,34.44 | 22.53,20.07 23.78,20.07 | U6.8 25.63,18.31 | 20.51,34.44 21.72,34.44 22.38,33.77 U5.8 22.18,32.45 22.18,31.1 20.89,29.81 19.54,29.81 19.05,29.32 C5.1 19.05,26 C6.1 19.06,21.71 20.71,20.07 22.53,20.07 | 19.18,34.44 19.84,33.77 | 19.84,33.77 U5.6 | 17.15,34.44 19.18,34.44 | 17.15,34.44 15.67,34.44 15.65,34.41 | 29.55,20.07 28.89,19.41 U10.6 28.89,19.49 28.31,20.07 | 30.76,20.07 31.23,19.61 31.23,19.56 31.43,19.36 U10.8 31.41,18.31 31.41,20.37 | 29.55,20.07 30.76,20.07 | 33.87,34.34 33.2,33.68 | 32.94,34.34 32.54,34.34 | 32.54,34.34 31.33,34.34 30.87,33.88 30.87,30.97 31.33,30.5 31.49,30.34 32.04,29.8 C9.1 C10.1 32.03,25.27 32.51,24.8 32.51,21.47 31.41,20.37 | 32.94,34.34 33.87,34.34 | 33.2,33.68 33.2,34.07 32.94,34.34 | 28.31,20.07 29.55,20.07 | 31.41,20.37 31.11,20.07 30.76,20.07
  Top 0.559: 34.86,34.34 35.08,34.34 35.74,33.68 U9.8 35.74,33.74 36.36,34.36 | 34.86,34.34 33.87,34.34 | 32.54,34.34 33.2,33.68 | 33.2,33.68 U9.6 | 42.98,19.99 42.32,19.33 U12.6 42.32,19.41 41.74,19.99 | 44.21,19.98 44.66,19.53 44.66,19.48 44.86,19.28 | 44.86,19.28 U12.8 44.84,18.24 | 42.98,19.99 44.2,19.99 44.21,19.98 | 39.72,34.36 39.05,33.7 | 38.79,34.36 38.39,34.36 | 38.79,34.36 39.72,34.36 | 39.05,33.7 39.05,34.1 38.79,34.36 | 41.74,19.99 42.98,19.99 | 39.72,34.36 40.93,34.36 41.59,33.7 U11.8 41.39,32.38 41.39,31.03 40.1,29.74 38.75,29.74 38.25,29.25 C11.1 38.25,25.93 C12.1 38.27,21.64 39.91,19.99 41.74,19.99 | 38.39,34.36 39.05,33.7 | 39.05,33.7 U11.6 | 36.36,34.36 38.39,34.36 | 36.36,34.36 34.88,34.36 34.86,34.34 | 48.75,19.98 48.08,19.32 U18.6 48.08,19.4 47.5,19.98 | 49.96,19.98 50.42,19.52 50.42,19.47 50.62,19.27 U18.8 50.6,18.22 50.6,20.28 | 48.75,19.98 49.96,19.98 | 53.06,34.25 52.4,33.58 | 52.13,34.25 51.73,34.25 | 51.73,34.25 50.52,34.25 50.06,33.79 50.06,30.87 50.53,30.41 50.69,30.25 51.23,29.7 C17.1 C18.1 51.23,25.18 51.7,24.71 51.7,21.38 50.6,20.28 | 52.13,34.25 53.06,34.25 | 52.4,33.58 52.4,33.98 52.13,34.25 | 47.5,19.98 48.75,19.98 | 50.6,20.28 50.3,19.98 49.96,19.98 | 54.05,34.25 54.27,34.25 54.94,33.58 U17.8 54.94,33.65 55.56,34.27 | 54.05,34.25 53.06,34.25 | 51.73,34.25 52.4,33.58 | 52.4,33.58 U17.6 | 62.18,19.9 61.51,19.24 U20.6 61.51,19.32 60.94,19.9 | 63.39,19.9 63.85,19.44 63.85,19.39 64.05,19.19 U20.8 | 62.18,19.9 63.39,19.9 | 58.91,34.27 58.25,33.61 | 57.98,34.27 57.58,34.27 | 57.98,34.27 58.91,34.27 | 58.25,33.61 58.25,34 57.98,34.27 | 60.94,19.9 62.18,19.9 | U20.8 64.03,18.15 | 58.91,34.27 60.12,34.27 60.79,33.61 U19.8 60.58,32.29 60.58,30.94 59.29,29.65 57.94,29.65 57.45,29.15 C19.1 57.45,25.84 C20.1 57.46,21.55 59.11,19.9 60.94,19.9
  Top 0.559: 57.58,34.27 58.25,33.61 | 58.25,33.61 U19.6 | 55.56,34.27 57.58,34.27 | 55.56,34.27 54.08,34.27 54.05,34.25 | 68.22,19.92 67.55,19.26 U26.6 67.55,19.34 66.98,19.92 | 69.43,19.92 69.89,19.46 69.89,19.41 70.09,19.21 U26.8 70.07,18.17 70.07,20.22 | 68.22,19.92 69.43,19.92 | 72.53,34.19 71.87,33.53 | 71.6,34.19 71.21,34.19 | 71.21,34.19 69.99,34.19 69.53,33.73 69.53,30.82 70,30.35 70.16,30.19 70.7,29.65 C25.1 C26.1 70.7,25.12 71.17,24.65 71.17,21.32 70.07,20.22 | 71.6,34.19 72.53,34.19 | 71.87,33.53 71.87,33.92 71.6,34.19 | 66.98,19.92 68.22,19.92 | 66.43,19.92 66.17,19.92 | 66.43,19.92 66.98,19.92 | 70.07,20.22 69.77,19.92 69.43,19.92 | 73.53,34.19 73.75,34.19 74.41,33.53 U25.8 74.41,33.59 75.03,34.21 | 73.53,34.19 72.53,34.19 | 71.21,34.19 71.87,33.53 | 71.87,33.53 U25.6 | 81.65,19.84 80.99,19.18 U28.6 80.99,19.27 80.41,19.84 | 78.38,34.21 77.72,33.55 | 77.45,34.21 77.05,34.21 | 77.45,34.21 78.38,34.21 | 77.72,33.55 77.72,33.95 77.45,34.21 | 80.41,19.84 81.65,19.84 | 83.5,18.09 U28.8 | 78.38,34.21 79.59,34.21 80.26,33.55 U27.8 80.06,32.23 80.06,30.88 78.77,29.59 77.41,29.59 76.92,29.1 C27.1 76.92,25.78 C28.1 76.93,21.49 78.58,19.84 80.41,19.84 | 77.05,34.21 77.72,33.55 | 77.72,33.55 U27.6 | 75.03,34.21 77.05,34.21 | 75.03,34.21 73.55,34.21 73.53,34.19 | 26.25,20.07 24.99,20.07 | 26.25,20.07 27.01,20.07 28.31,20.07 | U6.8 25.65,19.47 26.25,20.07 | 44.21,19.98 45.6,19.98 | 45.6,19.98 47.5,19.98 | 45.6,19.98 44.91,19.28 44.86,19.28 | 64.79,19.9 63.39,19.9 | 64.79,19.9 65.66,19.9 65.68,19.92 66.43,19.92 | 66.43,19.92 | U20.8 64.05,19.16 64.79,19.9 | J1.1 4.12,19.13 6.52,19.13 7.53,20.14 9.1,20.14 | 82.91,19.84 84.16,19.84 83.53,19.21 U28.8
  Top 0.559: 82.91,19.84 81.65,19.84 | 82.91,19.84 83.53,19.23 U28.8
  pour Top: 26.41,5.67 26.41,8.73 23.08,12.06 22.88,12.26 17.72,12.26 14.12,15.86 12.97,15.86 10.26,15.86 8.42,17.69 8.42,20.62 12.09,20.62 13.11,21.63 12.9,21.84 12.9,25.3 11.75,26.46 11.75,29.17 11.75,34.4 12.02,34.68 22.2,34.68 22.34,34.54 22.34,30.74 21.25,29.65 19.89,29.65 19.82,29.58 19.82,21.77 20.84,20.75 20.84,20.21 31.36,20.21 31.77,20.62 32.24,21.09 32.24,24.62 32.24,29.65 30.95,30.94 30.95,34.2 31.36,34.61 40.79,34.61 41.41,34 41.41,30.94 40.18,29.72 39.51,29.72 38.55,28.77 38.55,22.04 40.18,20.41 49.96,20.41 50.23,20.14 50.23,20.41 51.99,22.18 51.99,24.69 50.57,26.12 50.57,30.06 50.09,30.53 50.09,34.06 50.43,34.4 60.47,34.4 60.95,33.93 60.95,31.01 58.3,28.36 58.3,20.95 58.51,20.95 59.93,19.53 69.43,19.53 71.13,21.23 71.13,25.17 69.98,26.32 69.98,30.33 69.23,31.08 69.23,33.11 70.11,34 70.38,34.27 79.75,34.27 80.15,33.86 80.15,30.33 78.86,29.04 77.78,29.04 77.85,28.97 77.85,20.95 78.93,19.87 78.93,19.26 79.2,19.53 83.55,19.53 83.55,17.15 83.48,17.08 79.75,17.08 78.59,15.93 74.52,15.93 69.16,10.56 64.61,10.56 65.02,10.15 65.02,5.6 26.41,5.6